# EasyEDA schematic SCH_GAS DETECTION USING 8051_2022-04-11.json
TITLE: GAS DETECTION USING 8051; REV: 1.0; Date: 2022-04-11; Sheet: 1/1; Drawn By: Atul Dighe; Company: SAI SOLUTIONS PVT. LTD.
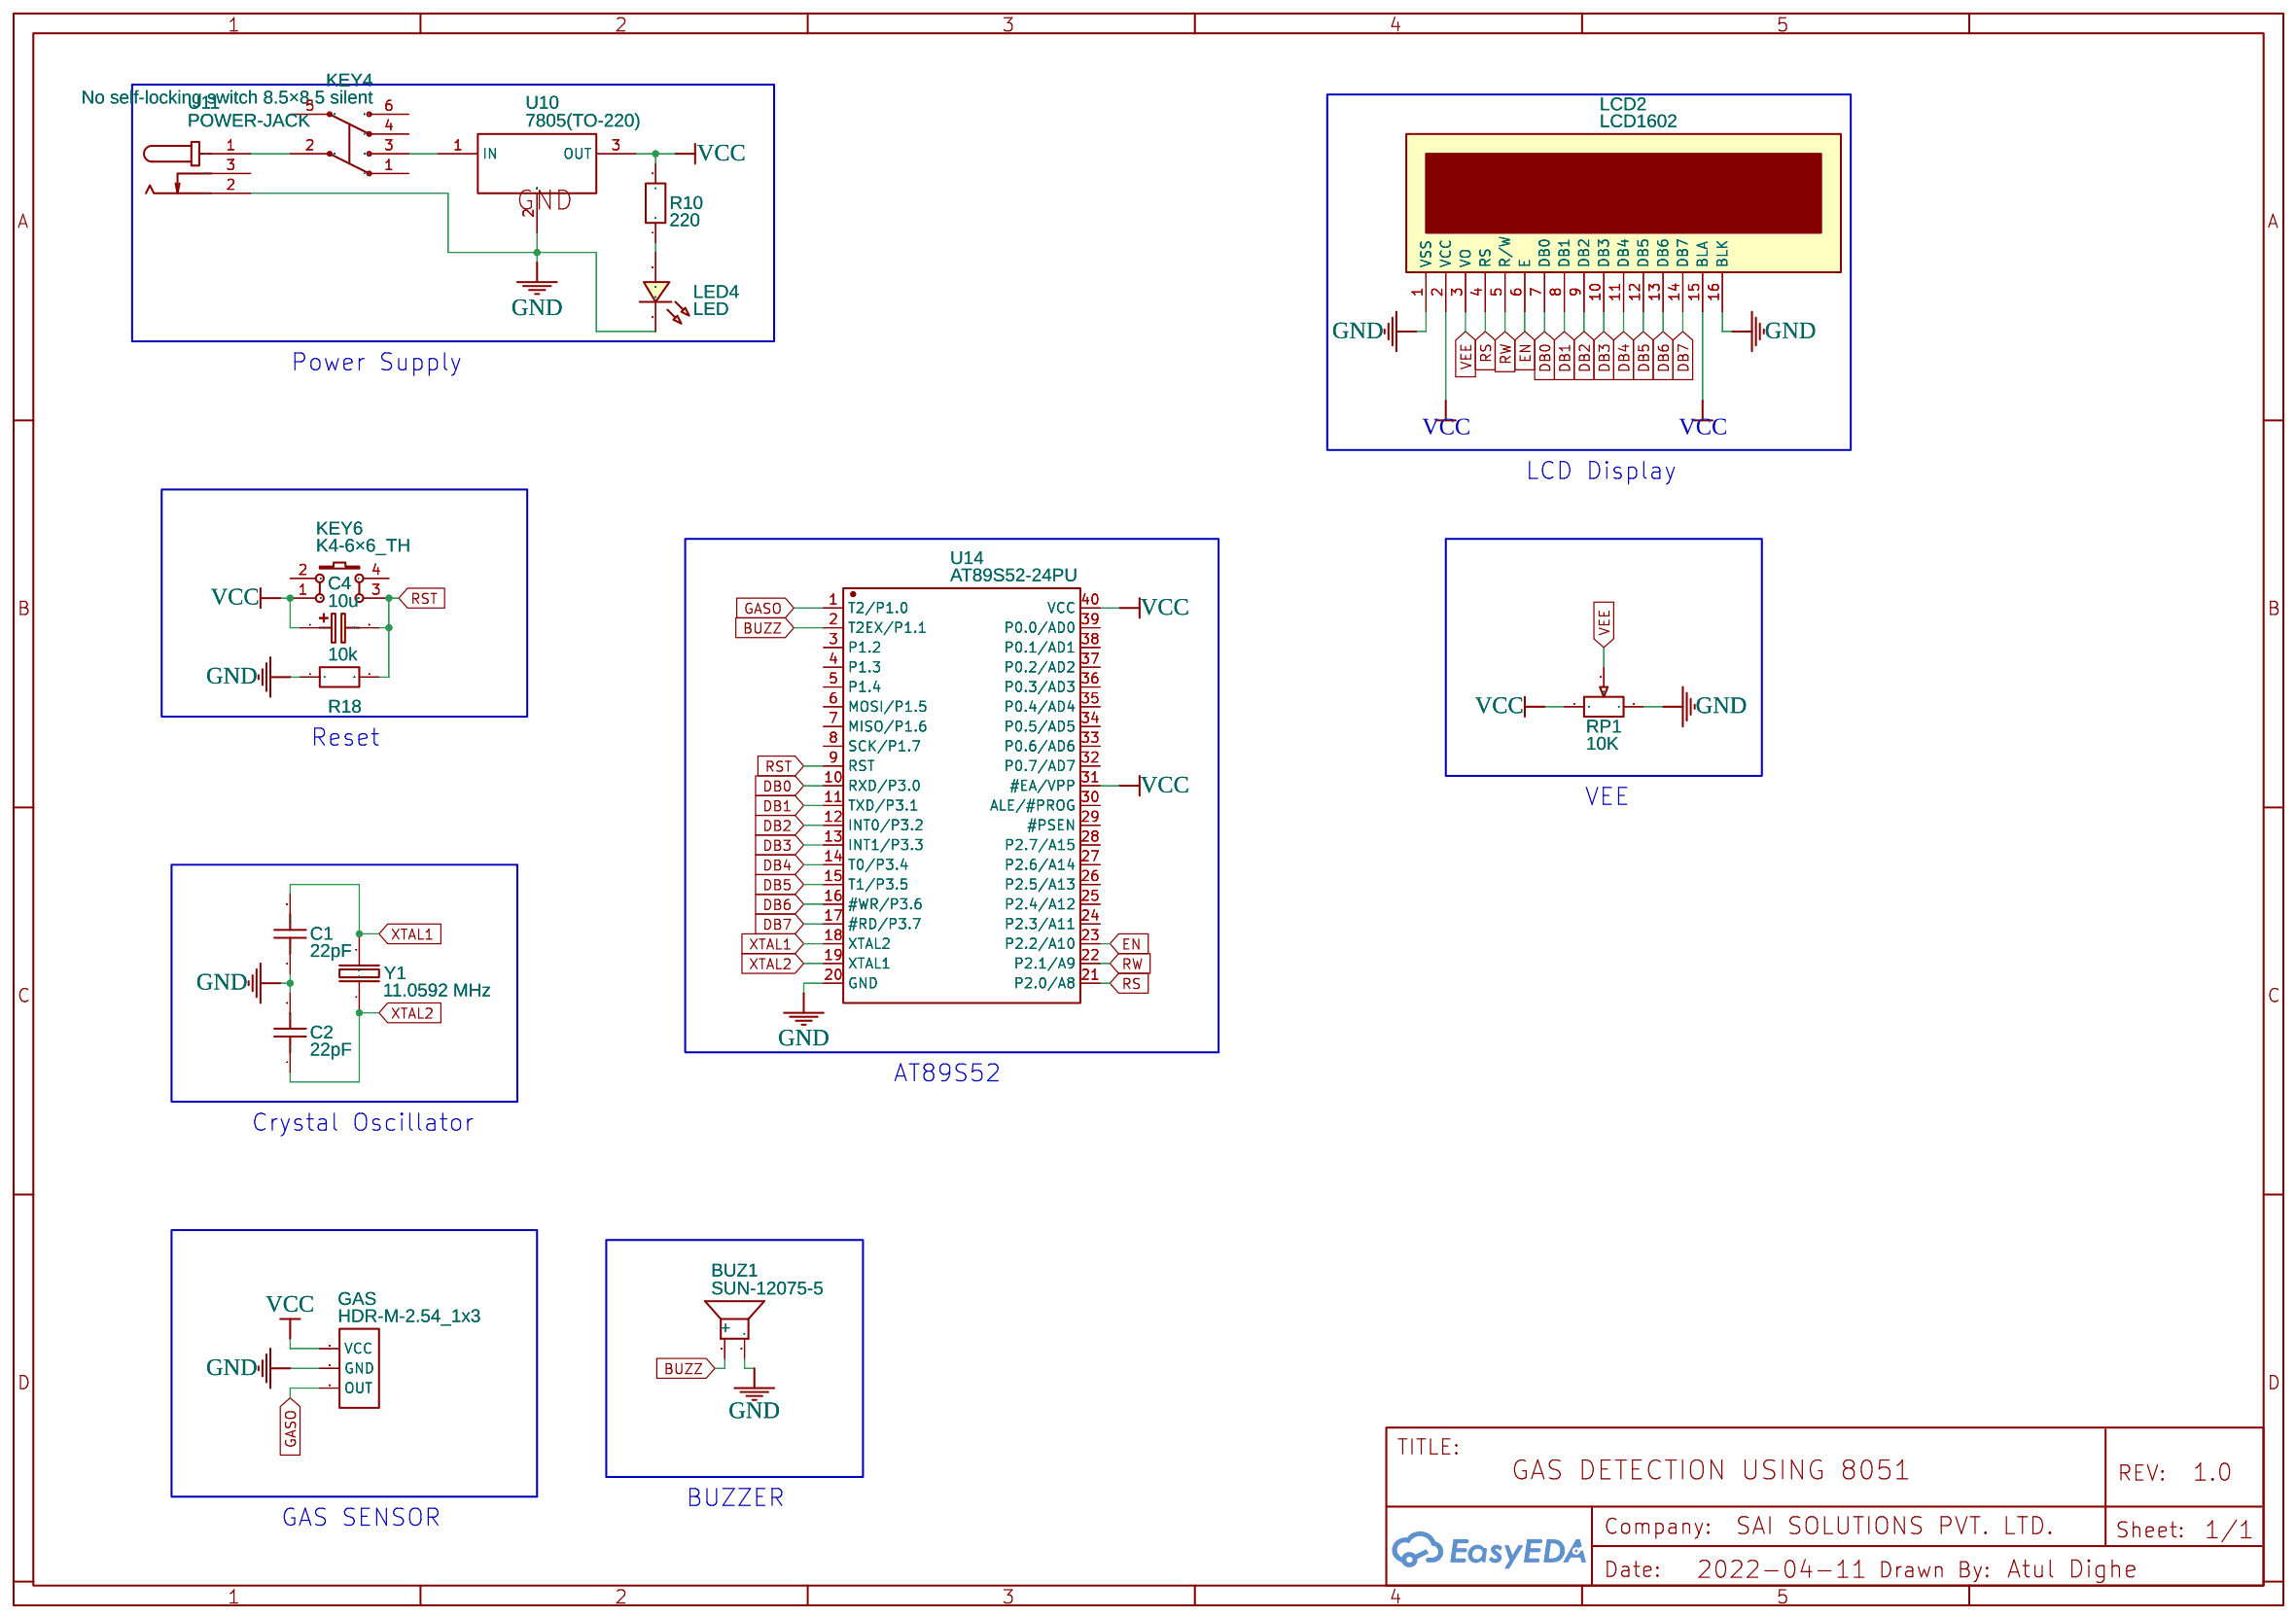
[diagram p0: schematic sheet]

## Parts
BUZ1  SUN-12075-5  [BUZ-TH_BD12.0-P7.60-D0.6-FD]
C1  22pF  [RAD-0.1]
C2  22pF  [RAD-0.1]
C4  10u  [CAP-D8.0×F3.5]
GAS  HDR-M-2.54_1x3  [HDR-M-2.54_1X3]
KEY4  No self-locking switch 8.5×8.5 silent  [SW-TH_6P-L8.5-W8.5-P2.54]
KEY6  K4-6×6_TH  [KEY-TH_4P-L6.0-W6.0-P4.50-LS6.5]
LCD2  LCD1602  [LCD1602]
LED4  LED  [LED-TH_BD3.0_RED]
R10  220  [R_AXIAL-0.3]
R18  10k  [R_AXIAL-0.3]
RP1  10K  [RES-ADJ-TH_3386P]
U10  7805(TO-220)  [TO-220-3_L10.0-W4.5-P2.54-L]
U11  POWER-JACK  [DC-IN-TH_POWER-JACK]
U14  AT89S52-24PU  [DIP-40_L52.3-W13.9-P2.54-LS15.2-BL]
Y1  11.0592 MHz  [CRYSTAL_OSCILLATOR_200MIL_PACKAGE]

## Library data of the parts
BUZ1 = SUN-12075-5: Supplier Part: C2864; Supplier: LCSC; Manufacturer: ReliaPro
C1 C2 = C_RAD-0.1_US: Contributor: LCEDA_Lib
C4 = CE_TH_D8.0×F3.5_EU: Contributor: LCEDA_Lib
GAS = HDR-M-2.54_1x3: Supplier Part: C180248; Supplier: LCSC; Contributor: LCEDA_Lib
KEY4 = No self-locking switch 8.5×8.5 silent: Supplier Part: C26228; Supplier: LCSC; Manufacturer: ReliaPro
KEY6 = K4-6×6_TH: Supplier: LCSC; Supplier Part: C136684; Manufacturer: 韩国韩荣; Manufacturer Part: K2-1102DP-E4SW-04; Contributor: LCEDA_Lib
LCD2 = LCD1602: Manufacturer: LONTECH(厦门龙特); Manufacturer Part: LCM1602K-NSW-BBW; Supplier Part: C83275; Supplier: LCSC; Contributor: LCEDA_Lib
LED4 = LED-TH-3mm_R: Manufacturer: EVERLIGHT(台湾亿光); Manufacturer Part: 204-10SDRD/S530-A3-L; Supplier Part: C84774; Supplier: LCSC; Contributor: LCEDA_Lib
R10 R18 = R_AXIAL-0.3_EU: Contributor: LCEDA_Lib
RP1 = R_3386P_EU: Supplier: LCSC; Contributor: LCEDA_Lib
U10 = 7805(TO-220): Supplier: LCSC; Manufacturer: STMicroelectronics; Manufacturer Part: L7805CV-DG; Supplier Part: C3795; Contributor: LCEDA_Lib
U11 = POWER-JACK: Supplier: LCSC; Supplier Part: C9900001795; Manufacturer: null; JLCPCB Part Class: Extended Part; Contributor: LCSC
U14 = AT89S52-24PU: Supplier: LCSC; Manufacturer: MICROCHIP; Supplier Part: C9441; JLCPCB Part Class: Extended Part
Y1 = ?MHz: Manufacturer Part: N/A; Contributor: jwtfpv

## Nets
GND: BUZ1.2 C1.1 C2.2 GAS.2(GND) LCD2.1(VSS) LCD2.16(BLK) LED4.2 R18.1 RP1.3 U10.2(GND) U11.2 U14.20(GND)
VCC: C4.1 GAS.1(VCC) KEY6.1 LCD2.2(VCC) LCD2.15(BLA) R10.2 RP1.1 U10.3(OUT) U14.31(#EA/VPP) U14.40(VCC)
VEE: LCD2.3(VO) RP1.2
BUZZ: BUZ1.1(+) U14.2(T2EX/P1.1)
DB0: LCD2.7(DB0) U14.10(RXD/P3.0)
DB1: LCD2.8(DB1) U14.11(TXD/P3.1)
DB2: LCD2.9(DB2) U14.12(INT0/P3.2)
DB3: LCD2.10(DB3) U14.13(INT1/P3.3)
DB4: LCD2.11(DB4) U14.14(T0/P3.4)
DB5: LCD2.12(DB5) U14.15(T1/P3.5)
DB6: LCD2.13(DB6) U14.16(#WR/P3.6)
DB7: LCD2.14(DB7) U14.17(#RD/P3.7)
EN: LCD2.6(E) U14.23(P2.2/A10)
GASO: GAS.3(OUT) U14.1(T2/P1.0)
RS: LCD2.4(RS) U14.21(P2.0/A8)
RST: C4.2 KEY6.3 R18.2 U14.9(RST)
RW: LCD2.5(R/W) U14.22(P2.1/A9)
XTAL1: C1.2 U14.18(XTAL2) Y1.2
XTAL2: C2.1 U14.19(XTAL1) Y1.1
Net-(KEY4-2): KEY4.2 U11.1
Net-(KEY4-3): KEY4.3 U10.1(IN)
Net-(LED4-1): LED4.1 R10.1

Not connected (* = marked no-connect by the designer): KEY4 1 4 5 6; KEY6 2 4; U11 3; U14 3(P1.2) 4(P1.3) 5(P1.4) 6(MOSI/P1.5) 7(MISO/P1.6) 8(SCK/P1.7) 24(P2.3/A11) 25(P2.4/A12) 26(P2.5/A13) 27(P2.6/A14) 28(P2.7/A15) 29(#PSEN) 30(ALE/#PROG) 32(P0.7/AD7) 33(P0.6/AD6) 34(P0.5/AD5) 35(P0.4/AD4) 36(P0.3/AD3) 37(P0.2/AD2) 38(P0.1/AD1) 39(P0.0/AD0)

## Notes on the sheet
- Power Supply
- LCD Display
- Reset
- VEE
- AT89S52
- Crystal Oscillator
- BUZZER
- GAS SENSOR
